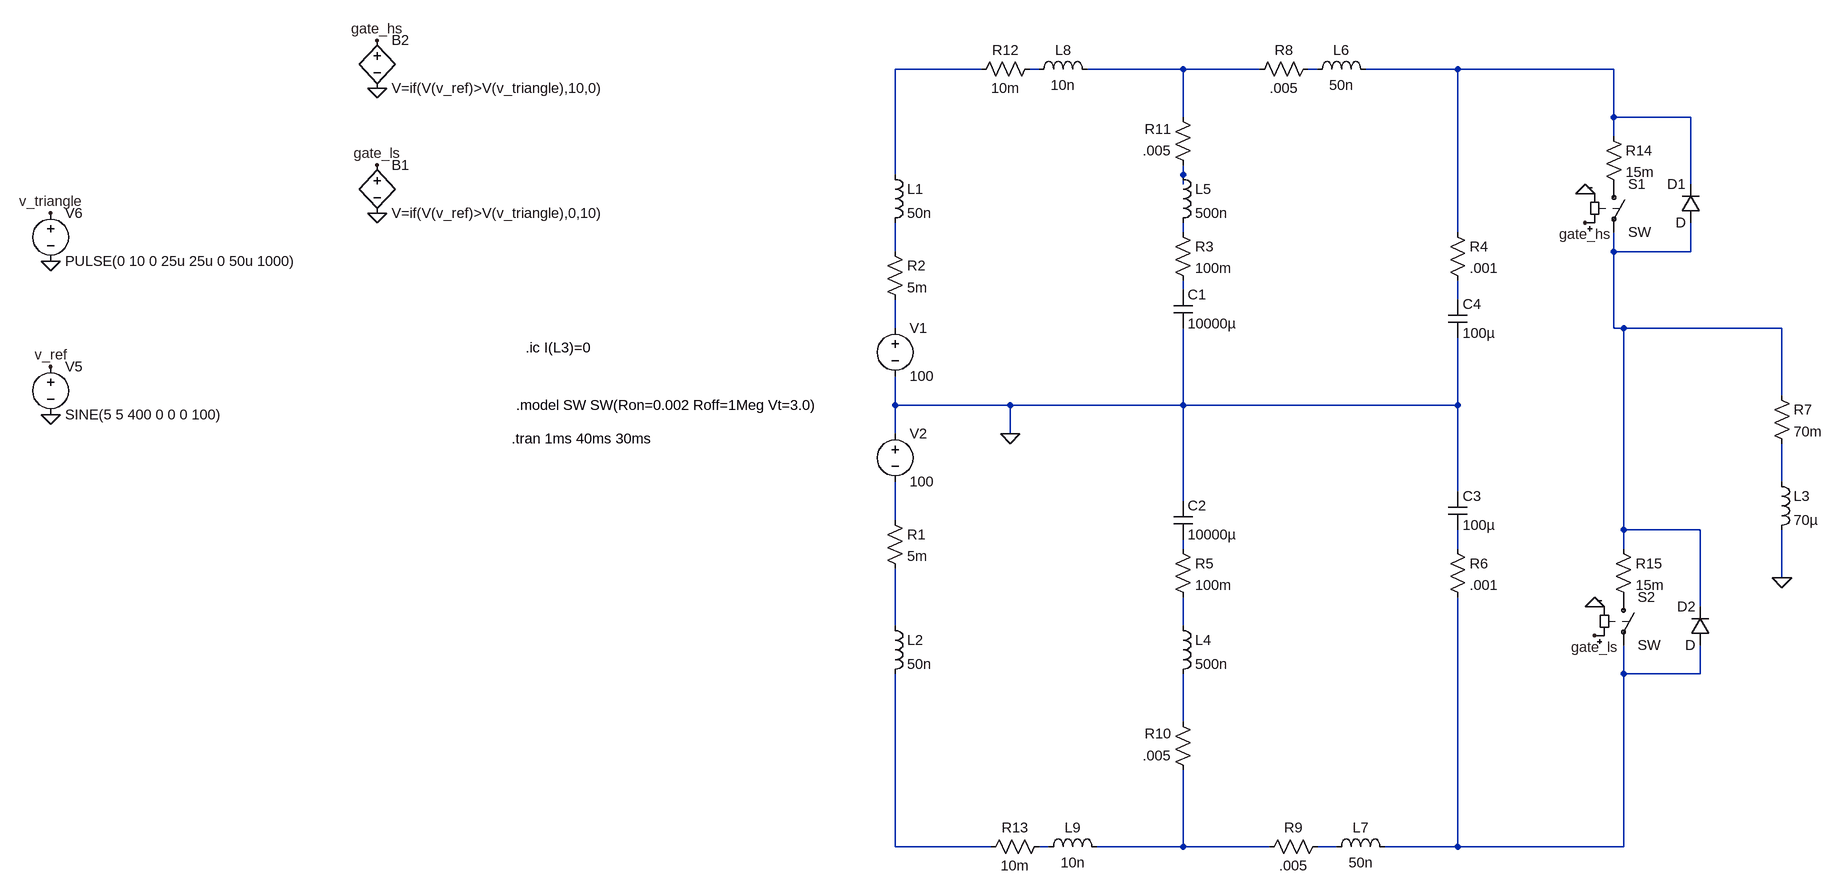
[diagram p0: schematic stator_drive.asc]
stator_drive.asc, the LTspice schematic file:
Version 4
SHEET 1 2088 1096
WIRE 192 -240 48 -240
WIRE 288 -240 272 -240
WIRE 528 -240 368 -240
WIRE 656 -240 528 -240
WIRE 752 -240 736 -240
WIRE 1024 -240 832 -240
WIRE 1616 -240 1024 -240
WIRE 528 -160 528 -240
WIRE 1616 -160 1616 -240
WIRE 1744 -160 1616 -160
WIRE 1616 -128 1616 -160
WIRE 48 -64 48 -240
WIRE 528 -64 528 -80
WIRE 528 -48 528 -64
WIRE 1744 -48 1744 -160
WIRE 528 32 528 16
WIRE 1024 32 1024 -240
WIRE 48 64 48 16
WIRE 1616 64 1616 32
WIRE 1744 64 1744 16
WIRE 1744 64 1616 64
WIRE 528 128 528 112
WIRE 1024 144 1024 112
WIRE 48 192 48 144
WIRE 1616 192 1616 64
WIRE 1632 192 1616 192
WIRE 2016 192 1632 192
WIRE 2016 304 2016 192
WIRE 48 320 48 272
WIRE 240 320 48 320
WIRE 528 320 528 192
WIRE 528 320 240 320
WIRE 1024 320 1024 208
WIRE 1024 320 528 320
WIRE 48 368 48 320
WIRE 240 368 240 320
WIRE 2016 448 2016 384
WIRE 1024 464 1024 320
WIRE 528 480 528 320
WIRE 48 512 48 448
WIRE 1632 528 1632 192
WIRE 1760 528 1632 528
WIRE 528 560 528 544
WIRE 1024 560 1024 528
WIRE 1632 560 1632 528
WIRE 2016 608 2016 528
WIRE 1760 656 1760 528
WIRE 48 688 48 592
WIRE 528 688 528 640
WIRE 1632 768 1632 720
WIRE 1760 768 1760 720
WIRE 1760 768 1632 768
WIRE 528 848 528 768
WIRE 48 1056 48 768
WIRE 208 1056 48 1056
WIRE 304 1056 288 1056
WIRE 528 1056 528 928
WIRE 528 1056 384 1056
WIRE 672 1056 528 1056
WIRE 784 1056 752 1056
WIRE 1024 1056 1024 640
WIRE 1024 1056 864 1056
WIRE 1632 1056 1632 768
WIRE 1632 1056 1024 1056
FLAG 240 368 0
FLAG 2016 608 0
FLAG 1568 16 gate_hs
FLAG 1568 -32 0
FLAG 1584 656 0
FLAG 1584 704 gate_ls
FLAG -1616 336 0
FLAG -1616 80 0
FLAG -1616 0 v_triangle
FLAG -1616 256 v_ref
FLAG -1072 0 0
FLAG -1072 -208 0
FLAG -1072 -288 gate_hs
FLAG -1072 -80 gate_ls
SYMBOL voltage 48 176 R0
SYMATTR InstName V1
SYMATTR Value 100
SYMBOL voltage 48 352 R0
SYMATTR InstName V2
SYMATTR Value 100
SYMBOL res 32 496 R0
SYMATTR InstName R1
SYMATTR Value 5m
SYMBOL res 32 48 R0
SYMATTR InstName R2
SYMATTR Value 5m
SYMBOL res 512 16 R0
SYMATTR InstName R3
SYMATTR Value 100m
SYMBOL res 1008 16 R0
SYMATTR InstName R4
SYMATTR Value .001
SYMBOL res 512 544 R0
SYMATTR InstName R5
SYMATTR Value 100m
SYMBOL res 1008 544 R0
SYMATTR InstName R6
SYMATTR Value .001
SYMBOL res 2000 288 R0
SYMATTR InstName R7
SYMATTR Value 70m
SYMBOL res 752 -256 R90
WINDOW 0 0 56 VBottom 2
WINDOW 3 32 56 VTop 2
SYMATTR InstName R8
SYMATTR Value .005
SYMBOL res 768 1040 R90
WINDOW 0 0 56 VBottom 2
WINDOW 3 32 56 VTop 2
SYMATTR InstName R9
SYMATTR Value .005
SYMBOL res 544 944 R180
WINDOW 0 36 76 Left 2
WINDOW 3 36 40 Left 2
SYMATTR InstName R10
SYMATTR Value .005
SYMBOL res 544 -64 R180
WINDOW 0 36 76 Left 2
WINDOW 3 36 40 Left 2
SYMATTR InstName R11
SYMATTR Value .005
SYMBOL cap 512 128 R0
SYMATTR InstName C1
SYMATTR Value 10000µ
SYMBOL cap 512 480 R0
SYMATTR InstName C2
SYMATTR Value 10000µ
SYMBOL cap 1008 464 R0
SYMATTR InstName C3
SYMATTR Value 100µ
SYMBOL cap 1008 144 R0
SYMATTR InstName C4
SYMATTR Value 100µ
SYMBOL ind 32 -80 R0
SYMATTR InstName L1
SYMATTR Value 50n
SYMBOL ind 32 672 R0
SYMATTR InstName L2
SYMATTR Value 50n
SYMBOL ind 2000 432 R0
SYMATTR InstName L3
SYMATTR Value 70µ
SYMBOL ind 512 672 R0
SYMATTR InstName L4
SYMATTR Value 500n
SYMBOL ind 512 -80 R0
SYMATTR InstName L5
SYMATTR Value 500n
SYMBOL ind 736 -224 R270
WINDOW 0 32 56 VTop 2
WINDOW 3 5 56 VBottom 2
SYMATTR InstName L6
SYMATTR Value 50n
SYMBOL ind 768 1072 R270
WINDOW 0 32 56 VTop 2
WINDOW 3 5 56 VBottom 2
SYMATTR InstName L7
SYMATTR Value 50n
SYMBOL res 288 -256 R90
WINDOW 0 0 56 VBottom 2
WINDOW 3 32 56 VTop 2
SYMATTR InstName R12
SYMATTR Value 10m
SYMBOL ind 272 -224 R270
WINDOW 0 32 56 VTop 2
WINDOW 3 5 56 VBottom 2
SYMATTR InstName L8
SYMATTR Value 10n
SYMBOL res 304 1040 R90
WINDOW 0 0 56 VBottom 2
WINDOW 3 32 56 VTop 2
SYMATTR InstName R13
SYMATTR Value 10m
SYMBOL ind 288 1072 R270
WINDOW 0 32 56 VTop 2
WINDOW 3 5 56 VBottom 2
SYMATTR InstName L9
SYMATTR Value 10n
SYMBOL sw 1616 -64 R0
SYMATTR InstName S1
SYMBOL sw 1632 624 R0
SYMATTR InstName S2
SYMBOL res 1600 -144 R0
SYMATTR InstName R14
SYMATTR Value 15m
SYMBOL res 1616 544 R0
SYMATTR InstName R15
SYMATTR Value 15m
SYMBOL voltage -1616 240 R0
SYMATTR InstName V5
SYMATTR Value SINE(5 5 400 0 0 0 100)
SYMBOL voltage -1616 -16 R0
SYMATTR InstName V6
SYMATTR Value PULSE(0 10 0 25u 25u 0 50u 1000)
SYMBOL bv -1072 -96 R0
SYMATTR InstName B1
SYMATTR Value V=if(V(v_ref)>V(v_triangle),0,10)
SYMBOL bv -1072 -304 R0
SYMATTR InstName B2
SYMATTR Value V=if(V(v_ref)>V(v_triangle),10,0)
SYMBOL diode 1760 16 R180
WINDOW 0 24 64 Left 2
WINDOW 3 24 0 Left 2
SYMATTR InstName D1
SYMBOL diode 1776 720 R180
WINDOW 0 24 64 Left 2
WINDOW 3 24 0 Left 2
SYMATTR InstName D2
TEXT -848 376 Left 2 !.tran 1ms 40ms 30ms
TEXT -840 320 Left 2 !.model SW SW(Ron=0.002 Roff=1Meg Vt=3.0)
TEXT -824 224 Left 2 !.ic I(L3)=0

The netlist it stands for:
* stator_drive.asc
V1 N012 0 100
V2 0 N014 100
R1 N014 N017 5m
R2 N008 N012 5m
R3 N007 N010 100m
R4 N005 N011 .001
R5 N015 N018 100m
R6 N016 N019 .001
R7 N009 N013 70m
R8 N004 N003 .005
R9 N024 N023 .005
R10 N023 N020 .005
R11 N006 N003 .005
C1 N010 0 10000µ
C2 0 N015 10000µ
C3 0 N016 100µ
C4 N011 0 100µ
L1 N001 N008 50n
L2 N017 N021 50n
L3 N013 0 70µ
L4 N018 N020 500n
L5 N006 N007 500n
L6 N004 N005 50n
L7 N024 N019 50n
R12 N002 N001 10m
L8 N002 N003 10n
R13 N022 N021 10m
L9 N022 N023 10n
S1 P001 N009 gate_hs 0 SW
S2 P002 N019 gate_ls 0 SW
R14 N005 P001 15m
R15 N009 P002 15m
V5 v_ref 0 SINE(5 5 400 0 0 0 100)
V6 v_triangle 0 PULSE(0 10 0 25u 25u 0 50u 1000)
B1 gate_ls 0 V=if(V(v_ref)>V(v_triangle),0,10)
B2 gate_hs 0 V=if(V(v_ref)>V(v_triangle),10,0)
D1 N009 N005 D
D2 N019 N009 D
.model D D
.lib standard.dio
.tran 1ms 40ms 30ms
.model SW SW(Ron=0.002 Roff=1Meg Vt=3.0)
.ic I(L3)=0
.backanno
.end